# EAGLE design mainboard_hole_din_pa3 (EAGLE 4.11)
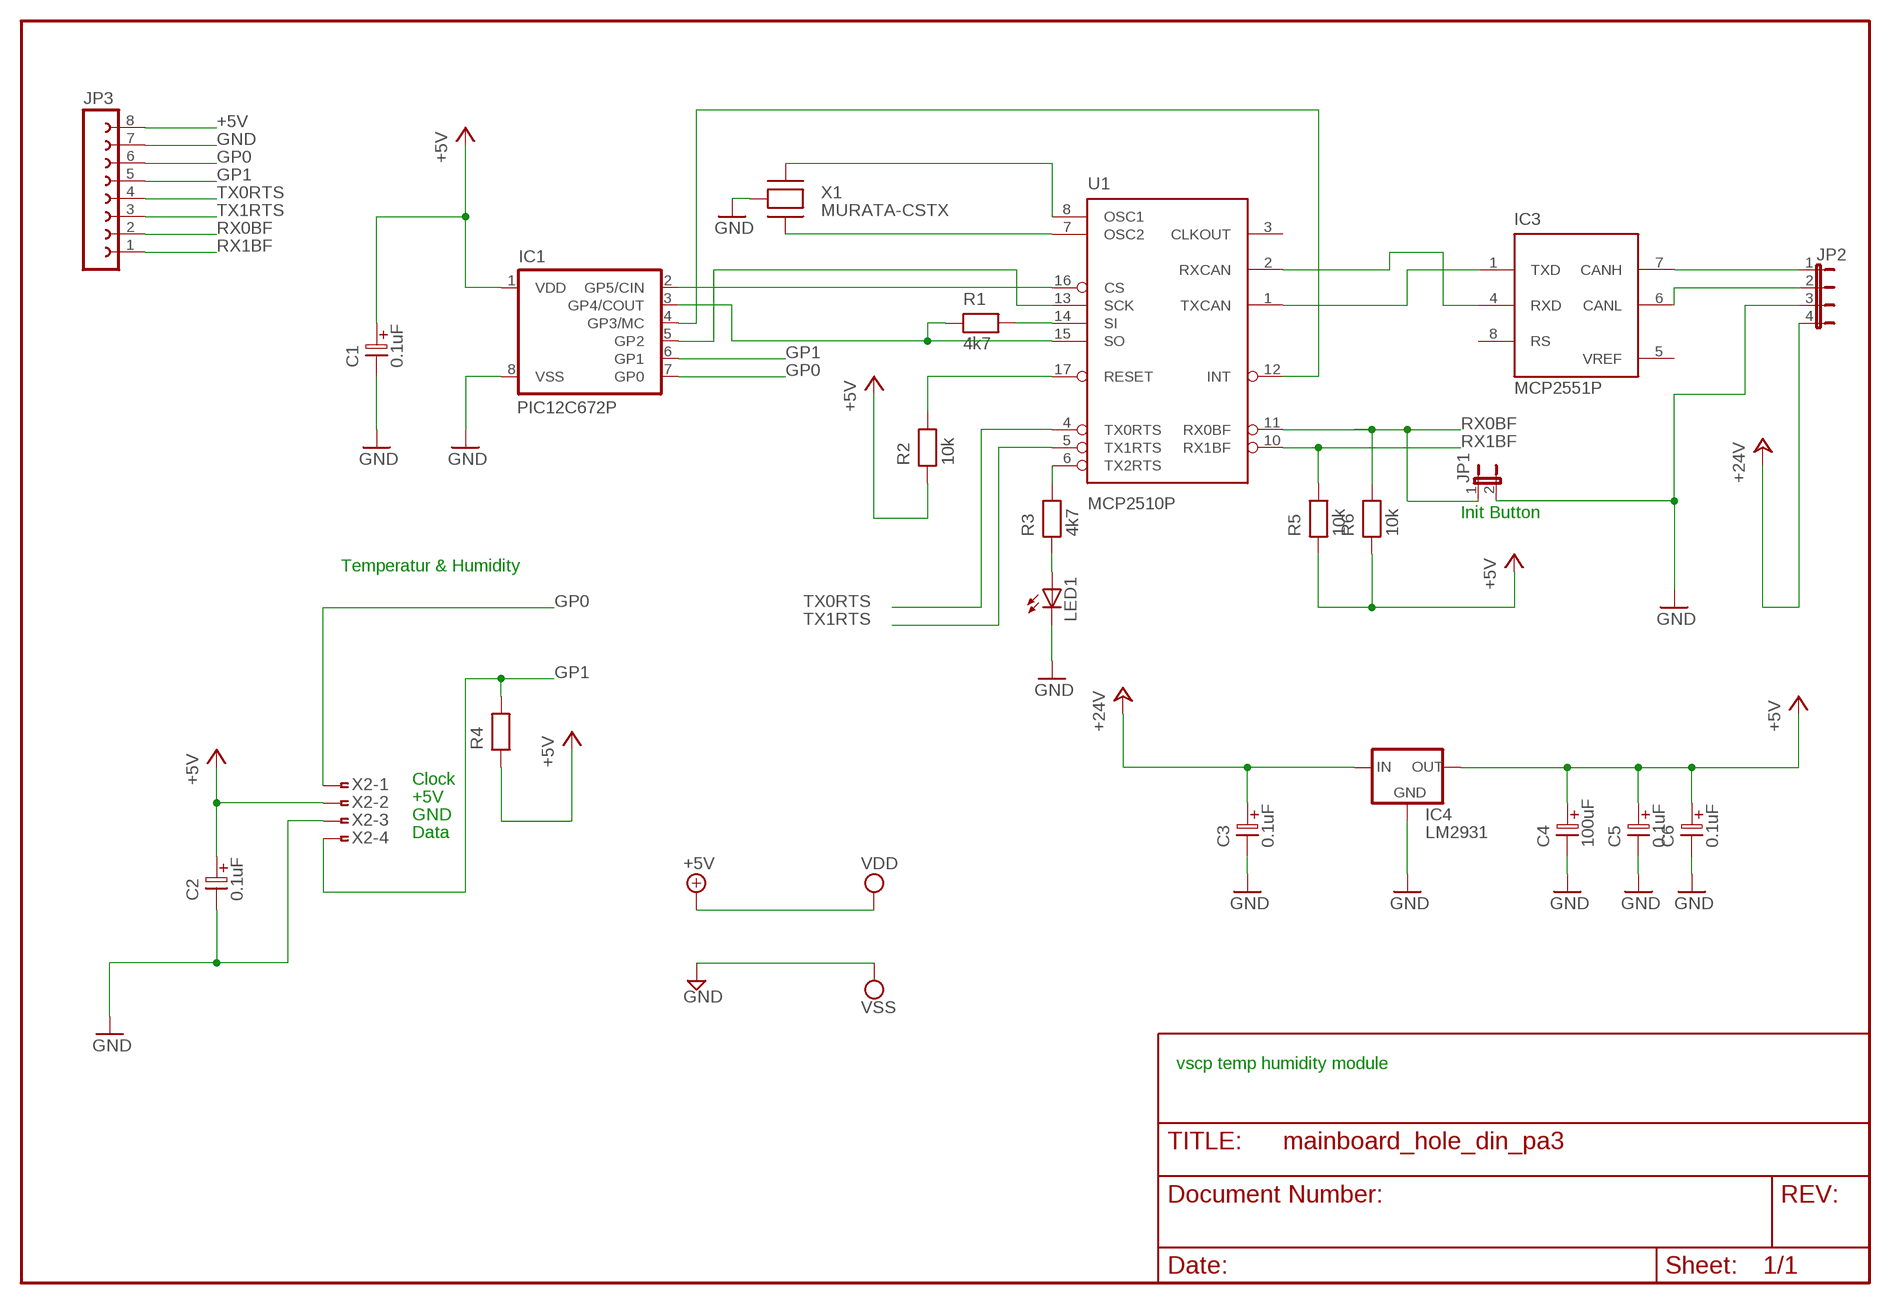
[diagram p0: schematic, sheet 1]

## Parts
C1  0.1uF  ELC-2,5  [ES-2,5]
C2  0.1uF  ELC-2,5  [ES-2,5]
C3  0.1uF  ELC-2,5  [ES-2,5]
C4  100uF  ELC-5  [ES-5]
C5  0.1uF  ELC-2,5  [ES-2,5]
C6  0.1uF  ELC-2,5  [ES-2,5]
IC1  PIC12C672P  [DIL8]
IC3  MCP2551P  [DIL8]
IC4  LM2931  78LXX  [78LXX]
JP1  JP1E  [JP1]
JP2  JP4E  [JP4]
JP3  FE08-1  [FE08]
LED1  LED3MM  [LED3MM]
R1  4k7  RESEU-5  [R-5]
R2  10k  RESEU-5  [R-5]
R3  4k7  RESEU-5  [R-5]
R4  RESEU-5  [R-5]
R5  10k  RESEU-5  [R-5]
R6  10k  RESEU-5  [R-5]
U1  MCP2510P  [DIL18]
X1  MURATA-CSTX  [RESONATOR-MURATA]
X2  FTOP-4  [FTOP-4]

## Nets
+5V: C1.1 C2.1 C4.1 C5.1 C6.1 IC1.1(VDD) IC4.OUT JP3.8 R2.1 R4.1 R5.1 R6.1 X2.2 ; supply symbol labelled VDD
+24V: C3.1 IC4.IN JP2.4
CANH: IC3.7(CANH) JP2.1
CANL: IC3.6(CANL) JP2.2
GND: C1.2 C2.2 C3.2 C4.2 C5.2 C6.2 IC1.8(VSS) IC4.GND JP1.2 JP2.3 JP3.7 LED1.K(C) X1.2(GND) X2.3 ; supply symbol labelled VSS
GP0: IC1.7(GP0) JP3.6 X2.1
GP1: IC1.6(GP1) JP3.5 R4.2 X2.4
GP2: IC1.5(GP2) U1.13(SCK)
GP3: IC1.4(GP3/MC) U1.12(INT)
GP4: IC1.3(GP4/COUT) R1.1 U1.15(SO)
GP5: IC1.2(GP5/CIN) U1.16(CS)
N$3: R2.2 U1.17(RESET)
N$7: R1.2 U1.14(SI)
N$10: LED1.A R3.1
OSC1: U1.8(OSC1) X1.1(XTIN)
OSC2: U1.7(OSC2) X1.3(XTOUT)
RX0BF: JP1.1 JP3.2 R6.2 U1.11(RX0BF)
RX1BF: JP3.1 R5.2 U1.10(RX1BF)
RXCAN: IC3.4(RXD) U1.2(RXCAN)
TX0RTS: JP3.4 U1.4(TX0RTS)
TX1RTS: JP3.3 U1.5(TX1RTS)
TX2RTS: R3.2 U1.6(TX2RTS)
TXCAN: IC3.1(TXD) U1.1(TXCAN)
Unconnected: IC3.8(RS) U1.3(CLKOUT)

## Notes on the sheet
- Init Button
- Temperatur & Humidity
- Clock
- +5V
- GND
- Data
- vscp temp humidity module

## Power pins joined to a net without a drawn wire
+5V: IC3.3(VDD) U1.18(VDD)
GND: IC3.2(VSS) U1.9(VSS)
VREF: IC3.5(VREF)

## Library data of the parts
C1-C3 C5 C6 = discrete:ELC-2,5
C4 = discrete:ELC-5
IC1 = microchip:PIC12C*?: MICROCONTROLLER
IC3 = microchip_can:MCP2551: High Speed CAN tranceiver
IC4 = v-reg:78LXX: VOLTAGE REGULATOR
JP1 = jumper:JP1E: JUMPER
JP2 = jumper:JP4E: JUMPER
JP3 = con-lsta:FE08-1: FEMALE HEADER
LED1 = led:LED: LED OSRAM: - CHIPLED LG R971, LG N971, LY N971, LG Q971, LY Q971, LO R971, LY R971 LH N974, LH R974 LS Q976, LO Q976, LY Q976 LO Q996 - Hyper CHIPLED LW Q18S LB Q993, LB Q99A, LB R99A - SideLED LS A670, LO A670, LY A670, LG A670, LP A670 LB A673, LV A673, LT A673, LW A673 LH A674 LY A675 LS A676, LA A676, LO A676, LY A676, LW A676 LS A679, LY A679, LG A679 - Hyper Micro SIDELED® LS Y876, LA Y876, LO Y876, LY Y876 LT Y87S - SmartLED LW L88C, LW L88S LB L89C, LB L89S, LG L890 LS L89K, LO L89K, LY L89K LS L896, LA L896, LO L896, LY L896 - TOPLED LS T670, LO T670, LY T670, LG T670, LP T670 LSG T670, LSP T670, LSY T670, LOP T670, LYG T670 LG T671, LOG T671, LSG T671 LB T673, LV T673, LT T673, LW T673 LH T674 LS T676, LA T676, LO T676, LY T676, LB T676, LH T676, LSB T676, LW T676 LB T67C, LV T67C, LT T67C, LS T67K, LO T67K, LY T67K, LW E67C LS E67B, LA E67B, LO E67B, LY E67B, LB E67C, LV E67C, LT E67C LW T67C LS T679, LY T679, LG T679 LS T770, LO T770, LY T770, LG T770, LP T770 LB T773, LV T773, LT T773, LW T773 LH T774 LS E675, LA E675, LY E675, LS T675 LS T776, LA T776, LO T776, LY T776, LB T776 LHGB T686 LT T68C, LB T68C - Hyper Mini TOPLED® LB M676 - Mini TOPLED Santana® LG M470 LS M47K, LO M47K, LY M47K Source: http://www.osram.convergy.de/
R1-R6 = discrete:RESEU-5
U1 = microchip_can:MCP2510
X1 = eurosource_ftdi:MURATA-CSTX
X2 = con-amp:FTOP-4: AMP connector

## Board
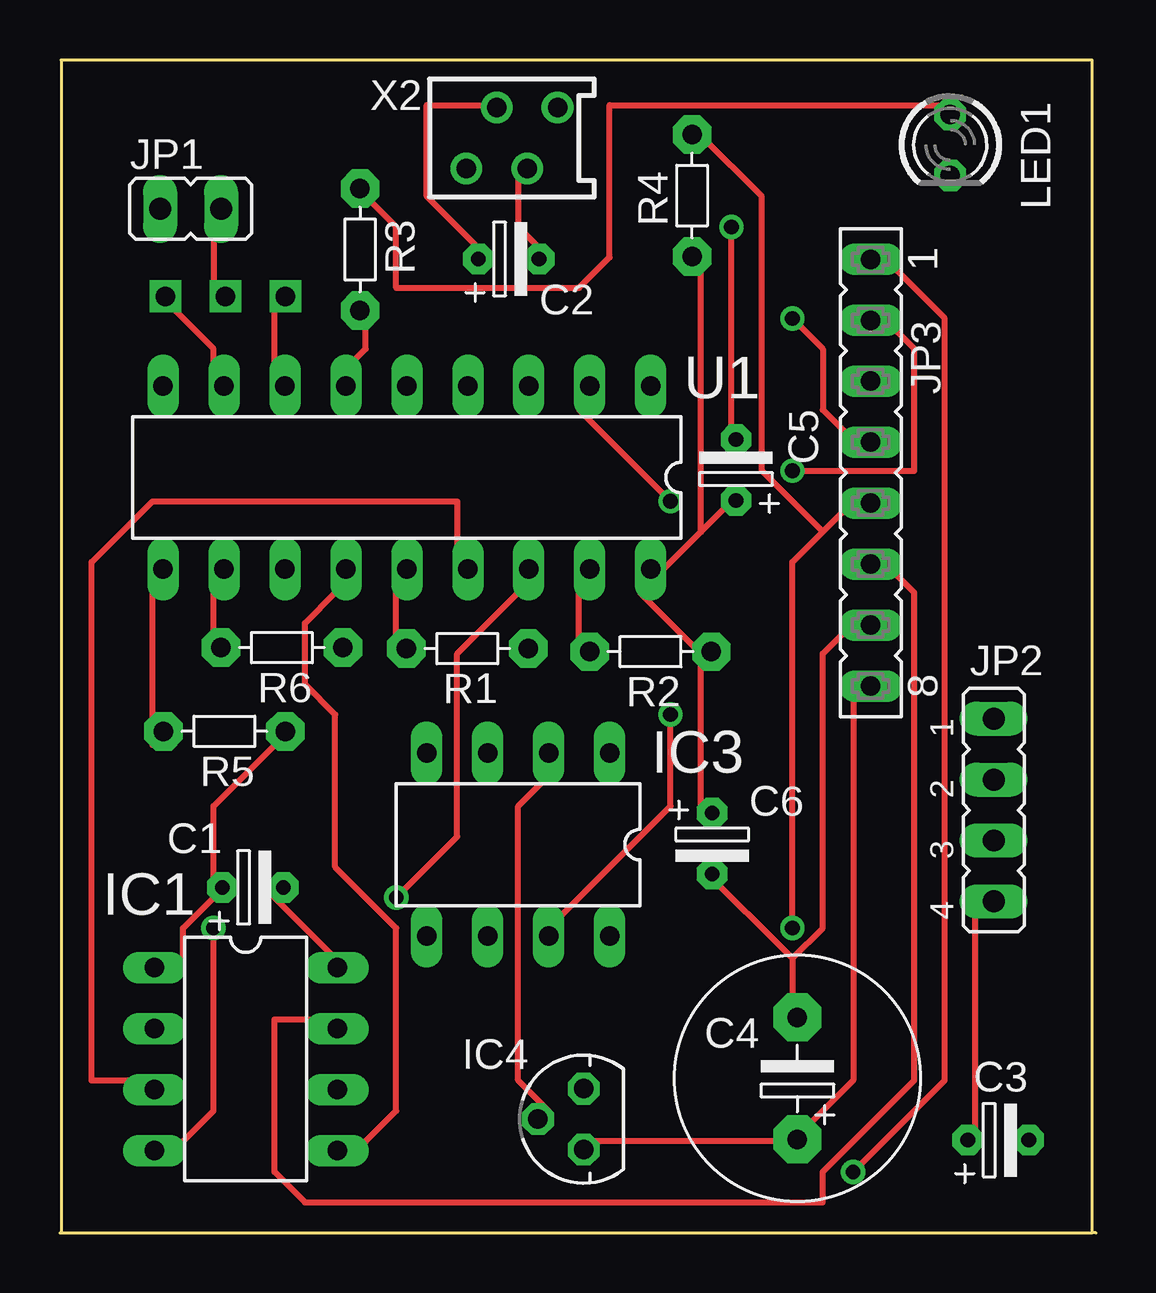
[diagram p1: board, top side]
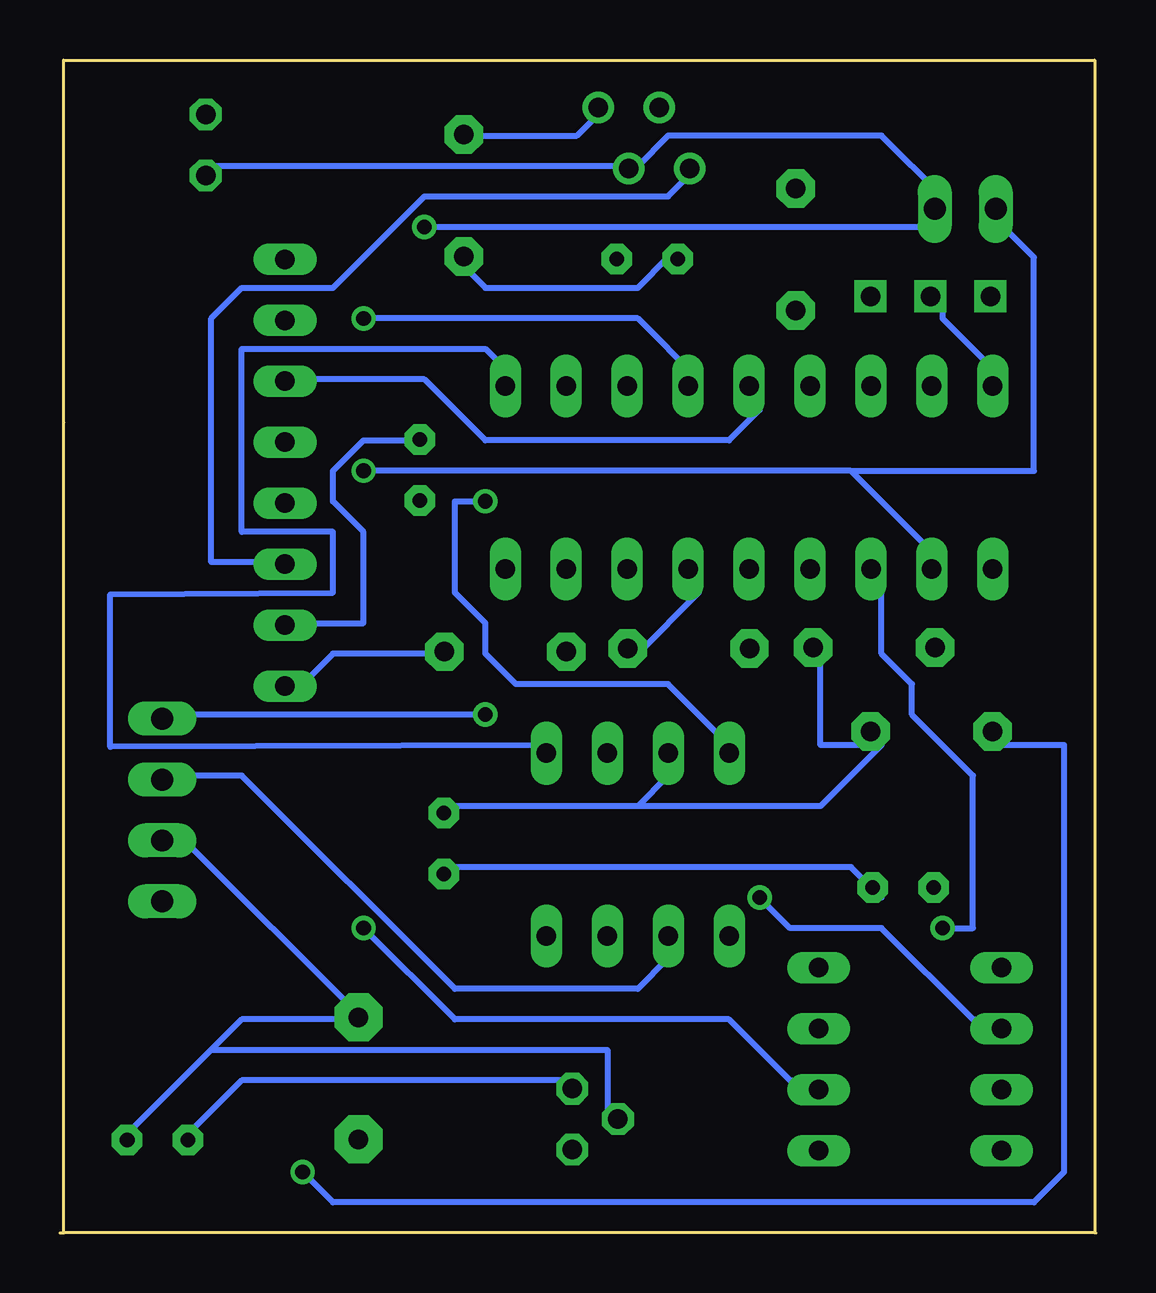
[diagram p2: board, bottom side, seen from below]

Size 43.18 x 48.87 mm. Coordinates in mm from the lower left corner, seen from the top.
Copper layers (1*16): Top 0.0254mm / dielectric 1.4986mm / Bottom 0.0254mm
Design rules "10mils": minimum track width 10mil, minimum drill 24mil, track to track 10mil, track to pad 10mil, pad to pad 10mil, via to via 10mil, smd to smd 10mil, copper to edge 40mil, drill to drill 10mil, minimum pad ring 10mil, minimum via ring 8mil, stop-mask expansion 0mil, vias tented up to drill 0mil, thermal gap 10mil

### Footprints (pad centres in the part's own frame; a part is rotated, then mirrored left to right if it is on the bottom)
ES-2,5 = drill 0.61 pad 1.27 octagon: 1 -1.27,0; 2 1.27,0
ES-5 = drill 0.813 pad 2.007 octagon: 1 -2.54,0; 2 2.54,0
DIL8 = drill 0.813 long: 1 -3.81,-3.81; 2 -1.27,-3.81; 3 1.27,-3.81; 4 3.81,-3.81; 5 3.81,3.81; 6 1.27,3.81; 7 -1.27,3.81; 8 -3.81,3.81
78LXX = drill 0.813 octagon: GND 0,1.905; IN 1.27,0; OUT -1.27,0
JP1 = drill 0.914 long: 1 0,-1.27; 2 0,1.27
JP4 = drill 0.914 long: 1 -3.81,0; 2 -1.27,0; 3 1.27,0; 4 3.81,0
FE08 = drill 0.813 long: 1 -8.89,0; 2 -6.35,0; 3 -3.81,0; 4 -1.27,0; 5 1.27,0; 6 3.81,0; 7 6.35,0; 8 8.89,0
LED3MM = drill 0.813 octagon: A -1.27,0; K 1.27,0
R-5 = drill 0.813 pad 1.6 octagon: 1 -2.54,0; 2 2.54,0
DIL18 = drill 0.813 long: 1 -10.16,-3.81; 2 -7.62,-3.81; 3 -5.08,-3.81; 4 -2.54,-3.81; 5 0,-3.81; 6 2.54,-3.81; 7 5.08,-3.81; 8 7.62,-3.81; 9 10.16,-3.81; 10 10.16,3.81; 11 7.62,3.81; 12 5.08,3.81; 13 2.54,3.81; 14 0,3.81; 15 -2.54,3.81; 16 -5.08,3.81; 17 -7.62,3.81; 18 -10.16,3.81
RESONATOR-MURATA = drill 0.813 square: 1 0,0; 2 2.5,0; 3 5,0
FTOP-4 = drill 0.813 round: 1 -1.905,-1.27; 2 -0.635,1.27; 3 0.635,-1.27; 4 1.905,1.27

### Placement (x,y rotation side)
C1  8.04,14.39 0 top
C2  18.7,40.57 0 top
C3  39.11,3.86 0 top
C4  30.74,6.44 90 top
C5  28.18,31.79 90 top
C6  27.19,16.22 270 top
IC1  7.74,7.24 270 top
IC3  19.1,16.18 180 top
IC4  21.83,4.74 90 top
JP1  5.45,42.66 270 top
JP2  38.92,17.62 270 top
JP3  33.8,31.67 270 top
LED1  37.11,45.33 270 top
R1  16.98,24.35 180 top
R2  24.62,24.21 180 top
R3  12.51,40.97 270 top
R4  26.35,43.22 90 top
R5  6.86,20.89 180 top
R6  9.25,24.38 180 top
U1  14.46,31.47 180 top
U$1  [DIN_SIMPLE]  0.05,0 0 top
X1  4.4,39.02 0 top
X2  18.84,45.62 0 top

### Tracks (layer width: path | path; a pad name or v marks a point on that pad's centre or on a via)
+5V
  Top 0.254: 6.4,13.97 5.13,12.7 5.13,11.43 IC1.1 | 6.4,13.97 6.4,17.78 8.94,20.32 R5.1 | 6.4,13.97 C1.1 | X2.2 17.83,46.99 15.29,46.99 15.29,43.18 17.83,40.64 C2.1 | 30.53,3.81 21.64,3.81 IC4.OUT | 24.18,26.67 26.72,29.21 | 26.72,29.21 27.99,30.48 C5.1 | 26.72,24.13 26.72,17.78 C6.1 | 26.72,24.13 24.18,26.67 | 24.18,26.67 U1.18 | 26.72,24.13 R2.1 | 30.53,3.81 33.07,6.35 33.07,22.86 JP3.8 | 30.53,3.81 C4.1 | 26.72,29.21 26.72,40.64 R4.1
  Bottom 0.254: 8.94,20.32 11.48,20.32 11.48,24.13 R6.1 | C2.1 17.83,40.64 19.1,39.37 25.45,39.37 26.72,40.64 R4.1 | 19.1,17.78 17.83,19.05 IC3.3 | 19.1,17.78 26.72,17.78 C6.1 | JP3.8 33.07,22.86 31.8,24.13 26.72,24.13 R2.1 | 8.94,20.32 11.48,17.78 19.1,17.78 | R5.1 8.94,20.32
+24V
  Top 0.254: C3.1 38.15,3.81 38.15,13.97 JP2.4
  Bottom 0.254: IC4.IN 21.64,6.35 35.61,6.35 38.15,3.81 C3.1
CANH  (via drill 0.61)
  Top 0.254: v25.45,21.59 25.45,17.78 20.37,12.7 IC3.7
  Bottom 0.254: v25.45,21.59 38.15,21.59 JP2.1
CANL
  Bottom 0.254: IC3.6 17.83,11.43 19.1,10.16 26.72,10.16 35.61,19.05 38.15,19.05 JP2.2
GND  (via drill 0.61)
  Top 0.254: JP1.2 6.4,41.91 6.4,39.37 X1.2 | C2.2 20.37,40.64 19.1,41.91 19.1,44.45 X2.3 | C1.2 8.94,13.97 11.48,11.43 IC1.8 | 30.53,11.43 26.72,15.24 C6.2 | 30.53,11.43 30.53,8.89 C4.2 | IC3.2 20.37,19.05 19.1,17.78 19.1,6.35 20.37,5.08 IC4.GND | 30.53,11.43 31.8,12.7 31.8,24.13 33.07,25.4 JP3.7 | v27.99,41.91 27.99,33.02 C5.2
  Bottom 0.254: U1.9 3.86,35.56 6.4,38.1 6.4,39.37 X1.2 | 19.1,44.45 36.88,44.45 LED1.K | 19.1,44.45 17.83,45.72 8.94,45.72 6.4,43.18 JP1.2 6.4,41.91 v27.99,41.91 | 19.1,44.45 X2.3 | C5.2 27.99,33.02 30.53,33.02 31.8,31.75 31.8,30.48 30.53,29.21 30.53,25.4 33.07,25.4 JP3.7 | 36.88,7.62 35.61,8.89 30.53,8.89 | 36.88,7.62 40.69,3.81 C3.2 | 36.88,7.62 20.37,7.62 20.37,5.08 IC4.GND | 30.53,8.89 38.15,16.51 JP2.3 | C4.2 30.53,8.89 | C1.2 8.94,13.97 10.21,15.24 26.72,15.24 C6.2
GP0
  Top 0.254: IC1.7 11.48,8.89 8.94,8.89 8.94,2.54 10.21,1.27 31.8,1.27 31.8,2.54 35.61,6.35 35.61,26.67 34.34,27.94 JP3.6
  Bottom 0.254: X2.1 16.56,44.45 17.83,43.18 27.99,43.18 31.8,39.37 35.61,39.37 36.88,38.1 36.88,27.94 34.34,27.94 JP3.6
GP1  (via drill 0.61)
  Top 0.254: v30.53,12.7 30.53,27.94 31.8,29.21 | 31.8,29.21 33.07,30.48 JP3.5 | 31.8,29.21 29.26,31.75 29.26,43.18 26.72,45.72 R4.2
  Bottom 0.254: X2.4 20.37,46.99 21.64,45.72 26.72,45.72 R4.2 | v30.53,12.7 26.72,8.89 15.29,8.89 12.75,6.35 IC1.6
GP2
  Top 0.254: IC1.5 12.75,3.81 14.02,5.08 14.02,12.7 11.48,15.24 11.48,21.59 10.21,22.86 10.21,25.4 11.48,26.67 U1.13
GP3  (via drill 0.61)
  Top 0.254: v6.4,12.7 6.4,5.08 5.13,3.81 IC1.4
  Bottom 0.254: v6.4,12.7 5.13,12.7 5.13,19.05 7.67,21.59 7.67,22.86 8.94,24.13 8.94,26.67 U1.12
GP4
  Top 0.254: IC1.3 3.86,6.35 1.32,6.35 1.32,27.94 3.86,30.48 16.56,30.48 16.56,27.94 U1.15
  Bottom 0.254: R1.1 19.1,24.13 16.56,26.67 U1.15
GP5  (via drill 0.61)
  Top 0.254: v14.02,13.97 16.56,16.51 16.56,24.13 19.1,26.67 U1.16
  Bottom 0.254: v14.02,13.97 12.75,12.7 8.94,12.7 5.13,8.89 IC1.2
N$3
  Top 0.254: U1.17 21.64,26.67 21.64,24.13 R2.2
N$7
  Top 0.254: U1.14 14.02,26.67 14.02,24.13 R1.2
N$10
  Top 0.254: LED1.A 36.88,46.99 22.91,46.99 22.91,40.64 21.64,39.37 14.02,39.37 14.02,41.91 12.75,43.18 R3.1
OSC1
  Top 0.254: U1.8 6.4,35.56 6.4,36.83 3.86,39.37 X1.1
OSC2
  Top 0.254: U1.7 8.94,35.56 8.94,39.37 X1.3
RX0BF  (via drill 0.61)
  Top 0.254: U1.11 6.4,26.67 6.4,24.13 R6.2 | v30.53,31.75 35.61,31.75 35.61,36.83 34.34,38.1 JP3.2
  Bottom 0.254: 10.21,31.75 v30.53,31.75 | 10.21,31.75 6.4,27.94 U1.11 | 10.21,31.75 2.59,31.75 2.59,40.64 3.86,41.91 JP1.1
RX1BF  (via drill 0.61)
  Top 0.254: U1.10 3.86,26.67 3.86,20.32 R5.2 | v33.07,2.54 36.88,6.35 36.88,38.1 34.34,40.64 JP3.1
  Bottom 0.254: v33.07,2.54 31.8,1.27 2.59,1.27 1.32,2.54 1.32,20.32 3.86,20.32 R5.2
RXCAN  (via drill 0.61)
  Top 0.254: v25.45,30.48 21.64,34.29 U1.2
  Bottom 0.254: v25.45,30.48 26.72,30.48 26.72,26.67 25.45,25.4 25.45,24.13 24.18,22.86 17.83,22.86 15.29,20.32 IC3.4
TX0RTS  (via drill 0.61)
  Top 0.254: v30.53,38.1 31.8,36.83 31.8,34.29 33.07,33.02 JP3.4
  Bottom 0.254: v30.53,38.1 19.1,38.1 16.56,35.56 U1.4
TX1RTS
  Bottom 0.254: U1.5 14.02,34.29 15.29,33.02 25.45,33.02 27.99,35.56 33.07,35.56 JP3.3
TX2RTS
  Top 0.254: U1.6 11.48,35.56 12.75,36.83 12.75,38.1 R3.2
TXCAN
  Bottom 0.254: IC3.1 22.91,20.32 41.08,20.25 41.08,26.6 31.8,26.67 31.8,29.21 35.61,29.21 35.61,36.83 25.45,36.83 24.18,35.56 U1.1